# EAGLE design led (EAGLE 7.5.0)
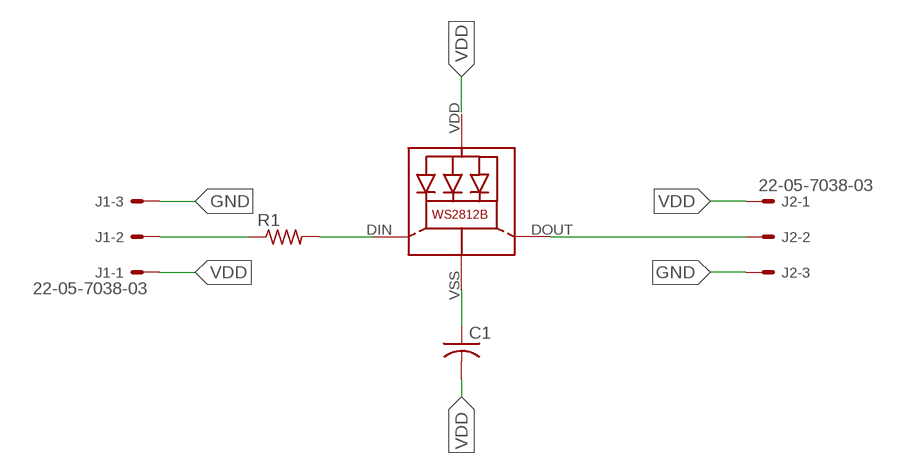
[diagram p0: schematic, sheet 1]

## Parts
C1  C-USC0603  [C0603]
J1  22-05-7038-03  [7395-03]
J2  22-05-7038-03  [7395-03]
LED1  WS2812B  [WS2812B]
R1  R-US_R0603  [R0603]

## Nets
GND: C1.1 J1.3 J2.3 LED1.VSS(GND)
N$2: J1.2 R1.1
N$3: LED1.DIN(DI) R1.2
N$4: J2.2 LED1.DOUT(DO)
VDD: C1.2 J1.1 J2.1

## Power pins joined to a net without a drawn wire
VDD: LED1.VDD

## Library data of the parts
C1 = resistor:C-US: CAPACITOR, American symbol
J1 J2 = con-molex:22-?-03: CONNECTOR wire to board 2.54 mm (.1 inch) pitch header; OC_FARNELL: unknown; OC_NEWARK: unknown
LED1 = adafruit:WS2812B: Features and Benefits  * Intelligent reverse connect protection, the power supply reverse connection does not damage the IC. * The control circuit and the LED share the only power source. Control circuit and RGB chip are integrated in a package of 5050 components, form a complete control of pixel point.  * Built-in signal reshaping circuit, after wave reshaping to the next driver, ensure wave-form distortion not accumulate.  * Built-in electric reset circuit and power lost reset circuit.  * Each pixel of the three primary color can achieve 256 brightness display, completed 16777216 color full color display, and scan frequency not less than 400Hz/s.  * Cascading port transmission signal by single line.  * Any two point the distance more than 5m transmission signal without any increase circuit.  * When the refresh rate is 30fps, cascade number are not less than1024 points.  * Send data at speeds of 800Kbps.  *The color of the light were highly consistent, cost-effective. Applications  Full-color module, Full color soft lights a lamp strip. LED decorative lighting, Indoor/outdoor LED video irregular screen. General description WS2812B is a intelligent control LED light source that the control circuit and RGB chip are integrated in a package of 5050 components. It internal include intelligent digital port data latch and signal reshaping amplification drive circuit. Also include a precision internal oscillator and a 12V voltage programmable constant curre-nt control part, effectively ensuring the pixel point light color height consistent. The data transfer protocol use single NZR communication mode. After the pixel power-on reset, the DIN port receive data from controller, the first pixel collect initial 24bit data then sent to the internal data latch, the other data which reshaping by the internal signal reshaping amplification circuit sent to the next cascade pixel through the DO port. After transmission for each pixel,the signal to reduce 24bit. pixel adopt auto reshaping transmit technology, making the pixel cascade number is not limited the signal transmission, only depend on the speed of signal transmission. LED with low driving voltage, environmental protection and energy saving, high brightness, scattering angle is large, good consistency, low power, long life and other advantages. The control chip integrated in LED above becoming more simple circuit, small volume, convenient installation. Absolute Maximum Ratings Power supply voltage: VDD +3.5V..+5.3V Input voltage: VI -0.5V..VDD+0.5V based on WS2812 from https://github.com/adafruit/Adafruit-Eagle-Library
R1 = resistor:R-US_: RESISTOR, American symbol

## Board
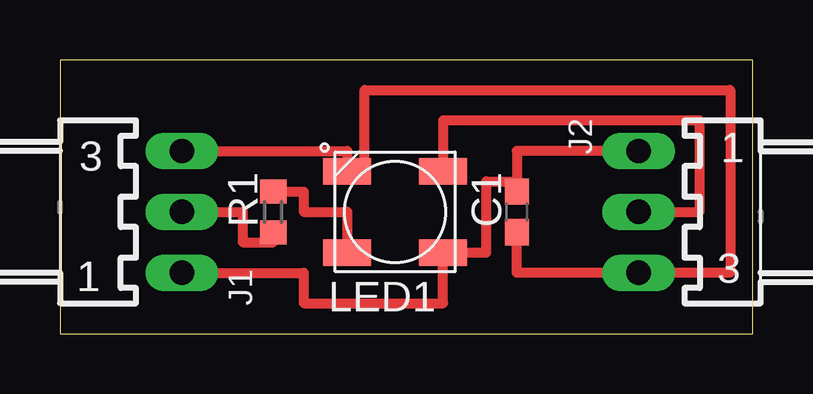
[diagram p1: board, top side]

Size 28.88 x 11.42 mm. Coordinates in mm from the lower left corner, seen from the top.
Outline: 0,0 28.88,0 28.88,11.42 0,11.42 0,0
Copper layers (1*16): Top 0.035mm / dielectric 1.5mm / Bottom 0.035mm
Design rules "default": minimum track width 10mil, minimum drill 24mil, track to track 8mil, track to pad 8mil, pad to pad 8mil, via to via 8mil, smd to smd 8mil, copper to edge 40mil, drill to drill 8mil, minimum pad ring 10mil, minimum via ring 8mil, stop-mask expansion 4mil, vias tented up to drill 0mil, thermal gap 10mil

### Footprints (pad centres in the part's own frame; a part is rotated, then mirrored left to right if it is on the bottom)
C0603 = smd 1.1 x 1: 1 -0.85,0; 2 0.85,0
7395-03 = drill 1.016 long: 1 2.54,0; 2 0,0; 3 -2.54,0
WS2812B = smd 2 x 1.1: DIN 2,1.7; DOUT -2,-1.7; VDD -2,1.7; VSS 2,-1.7
R0603 = smd 1 x 1.1: 1 -0.85,0; 2 0.85,0

### Placement (x,y rotation side)
C1  19.05,5.08 90 top
J1  5.08,5.08 270 top
J2  24.13,5.08 90 top
LED1  13.97,5.08 180 top
R1  8.89,5.08 90 top

### Tracks (layer width: path | path; a pad name or v marks a point on that pad's centre or on a via)
GND
  Top 0.406: J1.3 11.97,7.62 LED1.VSS 12.7,6.78 12.7,10.16 27.94,10.16 27.94,2.54 J2.3 19.05,2.54 C1.1
N$2
  Top 0.406: J1.2 7.62,5.08 7.62,3.81 8.89,3.81 R1.1
N$3
  Top 0.406: R1.2 10.16,5.93 10.16,5.08 11.97,5.08 LED1.DIN
N$4
  Top 0.406: J2.2 26.67,5.08 26.67,8.89 15.97,8.89 LED1.DOUT
VDD
  Top 0.406: J1.1 10.16,2.54 10.16,1.27 15.97,1.27 LED1.VDD 17.78,3.38 17.78,6.35 19.05,6.35 C1.2 19.05,7.62 J2.1